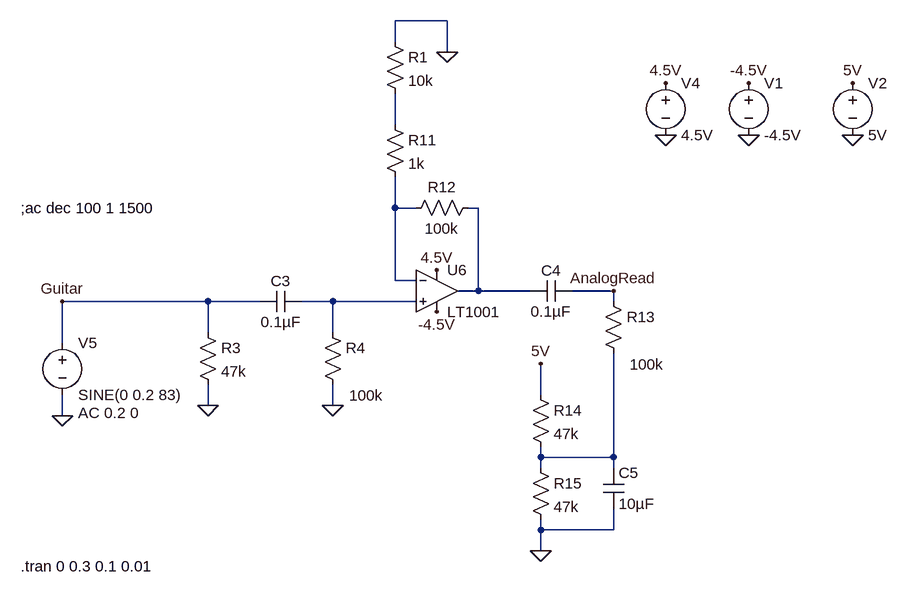
[diagram p0: schematic guitare amplification.asc]
guitare amplification.asc, the LTspice schematic file:
Version 4
SHEET 1 1540 964
WIRE -288 80 -368 80
WIRE -368 112 -368 80
WIRE -288 128 -288 80
WIRE -368 240 -368 192
WIRE -368 368 -368 320
WIRE -336 368 -368 368
WIRE -240 368 -256 368
WIRE -368 480 -368 368
WIRE -336 480 -368 480
WIRE -240 496 -240 368
WIRE -240 496 -272 496
WIRE -160 496 -240 496
WIRE -32 496 -96 496
WIRE -656 512 -880 512
WIRE -576 512 -656 512
WIRE -464 512 -512 512
WIRE -336 512 -464 512
WIRE -32 512 -32 496
WIRE -656 560 -656 512
WIRE -464 560 -464 512
WIRE -880 576 -880 512
WIRE -144 656 -144 608
WIRE -656 672 -656 640
WIRE -464 672 -464 640
WIRE -880 688 -880 656
WIRE -144 752 -144 736
WIRE -32 752 -32 592
WIRE -32 752 -144 752
WIRE -144 768 -144 752
WIRE -32 768 -32 752
WIRE -144 864 -144 848
WIRE -32 864 -32 832
WIRE -32 864 -144 864
WIRE -144 896 -144 864
FLAG 48 256 0
FLAG 176 256 0
FLAG 48 176 4.5V
FLAG 176 176 -4.5V
FLAG 336 256 0
FLAG 336 176 5V
FLAG -880 688 0
FLAG -656 672 0
FLAG -144 896 0
FLAG -144 608 5V
FLAG -464 672 0
FLAG -304 464 4.5V
FLAG -304 528 -4.5V
FLAG -288 128 0
FLAG -32 496 AnalogRead
FLAG -880 512 Guitar
SYMBOL voltage 48 160 R0
WINDOW 123 0 0 Left 2
WINDOW 39 0 0 Left 2
SYMATTR InstName V4
SYMATTR Value 4.5V
SYMBOL voltage 176 160 R0
WINDOW 123 0 0 Left 2
WINDOW 39 0 0 Left 2
SYMATTR InstName V1
SYMATTR Value -4.5V
SYMBOL voltage 336 160 R0
WINDOW 123 0 0 Left 2
WINDOW 39 0 0 Left 2
SYMATTR InstName V2
SYMATTR Value 5V
SYMBOL voltage -880 560 R0
WINDOW 123 24 124 Left 2
WINDOW 39 0 0 Left 2
SYMATTR Value2 AC 0.2 0
SYMATTR InstName V5
SYMATTR Value SINE(0 0.2 83)
SYMBOL cap -512 496 R90
WINDOW 0 0 32 VBottom 2
WINDOW 3 32 32 VTop 2
SYMATTR InstName C3
SYMATTR Value 0.1µF
SYMBOL res -480 544 R0
WINDOW 3 41 113 Left 2
SYMATTR Value 100k
SYMATTR InstName R4
SYMBOL res -672 544 R0
SYMATTR InstName R3
SYMATTR Value 47k
SYMBOL res -48 496 R0
WINDOW 3 41 113 Left 2
SYMATTR Value 100k
SYMATTR InstName R13
SYMBOL res -160 640 R0
SYMATTR InstName R14
SYMATTR Value 47k
SYMBOL res -160 752 R0
SYMATTR InstName R15
SYMATTR Value 47k
SYMBOL cap -48 768 R0
SYMATTR InstName C5
SYMATTR Value 10µF
SYMBOL Opamps\\LT1001 -304 432 R0
SYMATTR InstName U6
SYMBOL res -384 224 R0
SYMATTR InstName R11
SYMATTR Value 1k
SYMBOL res -240 352 R90
WINDOW 0 0 56 VBottom 2
WINDOW 3 32 56 VTop 2
SYMATTR InstName R12
SYMATTR Value 100k
SYMBOL cap -96 480 R90
WINDOW 0 0 32 VBottom 2
WINDOW 3 32 32 VTop 2
SYMATTR InstName C4
SYMATTR Value 0.1µF
SYMBOL res -384 96 R0
SYMATTR InstName R1
SYMATTR Value 10k
TEXT -944 368 Left 2 !;ac dec 100 1 1500
TEXT -944 920 Left 2 !.tran 0 0.3 0.1 0.01

The netlist it stands for:
* guitare amplification.asc
V4 4.5V 0 4.5V
V1 -4.5V 0 -4.5V
V2 5V 0 5V
V5 Guitar 0 SINE(0 0.2 83) AC 0.2 0
C3 N004 Guitar 0.1µF
R4 N004 0 100k
R3 Guitar 0 47k
R13 AnalogRead N005 100k
R14 5V N005 47k
R15 N005 0 47k
C5 N005 0 10µF
XU6 N004 N002 4.5V -4.5V N003 LT1001  ; pins In+ In- V+ V- OUT
R11 N001 N002 1k
R12 N003 N002 100k
C4 AnalogRead N003 0.1µF
R1 0 N001 10k
;ac dec 100 1 1500
.tran 0 0.3 0.1 0.01
.lib LTC.lib
.backanno
.end